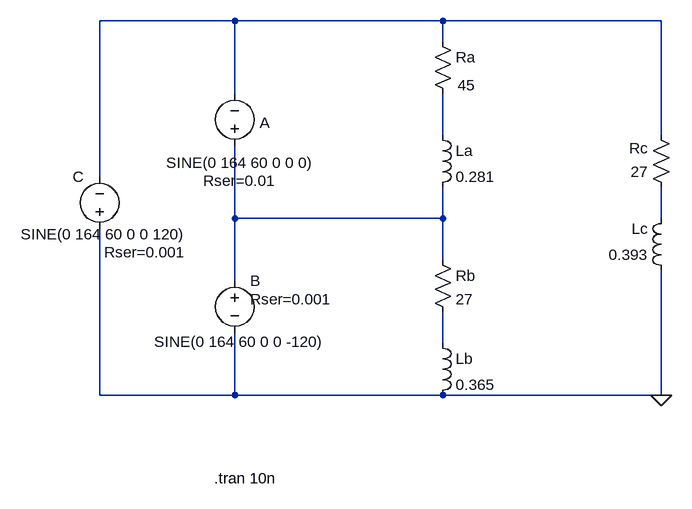
[diagram p0: schematic треугольник.asc]
треугольник.asc, the LTspice schematic file:
Version 4
SHEET 1 880 680
WIRE -288 -80 -496 -80
WIRE 32 -80 -288 -80
WIRE 368 -80 32 -80
WIRE 32 -48 32 -80
WIRE -288 32 -288 -80
WIRE 32 96 32 32
WIRE 368 96 368 -80
WIRE -496 160 -496 -80
WIRE -288 224 -288 112
WIRE 32 224 32 176
WIRE 32 224 -288 224
WIRE 368 224 368 176
WIRE 32 288 32 224
WIRE -288 320 -288 224
WIRE 32 416 32 368
WIRE -496 496 -496 240
WIRE -288 496 -288 400
WIRE -288 496 -496 496
WIRE 32 496 -288 496
WIRE 368 496 368 304
WIRE 368 496 32 496
FLAG 368 496 0
SYMBOL voltage -288 128 R180
WINDOW 0 -46 67 Bottom 2
WINDOW 3 -8 -26 Top 2
WINDOW 123 0 0 Left 0
WINDOW 39 -8 -54 Top 2
SYMATTR InstName A
SYMATTR Value SINE(0 164 60 0 0 0)
SYMATTR SpiceLine Rser=0.01
SYMBOL voltage -288 304 R0
WINDOW 3 -124 110 Left 2
WINDOW 123 0 0 Left 0
WINDOW 39 24 44 Left 2
SYMATTR Value SINE(0 164 60 0 0 -120)
SYMATTR InstName B
SYMATTR SpiceLine Rser=0.001
SYMBOL voltage -496 256 R180
WINDOW 0 24 96 Left 2
WINDOW 3 -133 8 Left 2
WINDOW 123 0 0 Left 0
WINDOW 39 -133 -20 Left 2
SYMATTR InstName C
SYMATTR Value SINE(0 164 60 0 0 120)
SYMATTR SpiceLine Rser=0.001
SYMBOL res 16 272 R0
SYMATTR InstName Rb
SYMATTR Value 27
SYMBOL res 384 192 R180
WINDOW 0 36 76 Left 2
WINDOW 3 36 40 Left 2
SYMATTR InstName Rc
SYMATTR Value 27
SYMBOL ind 16 400 R0
SYMATTR InstName Lb
SYMATTR Value 0.365
SYMBOL ind 384 320 R180
WINDOW 0 36 80 Left 2
WINDOW 3 36 40 Left 2
SYMATTR InstName Lc
SYMATTR Value 0.393
SYMBOL res 16 -64 R0
WINDOW 3 39 83 Left 2
SYMATTR Value 45
SYMATTR InstName Ra
SYMBOL ind 16 80 R0
SYMATTR InstName La
SYMATTR Value 0.281
TEXT -320 624 Left 2 !.tran 10n

The netlist it stands for:
* треугольник.asc
V§A N003 N001 SINE(0 164 60 0 0 0) Rser=0.01
V§B N003 0 SINE(0 164 60 0 0 -120) Rser=0.001
V§C 0 N001 SINE(0 164 60 0 0 120) Rser=0.001
Rb N003 N005 27
Rc N004 N001 27
Lb N005 0 0.365
Lc 0 N004 0.393
Ra N001 N002 45
La N002 N003 0.281
.tran 10n
.backanno
.end